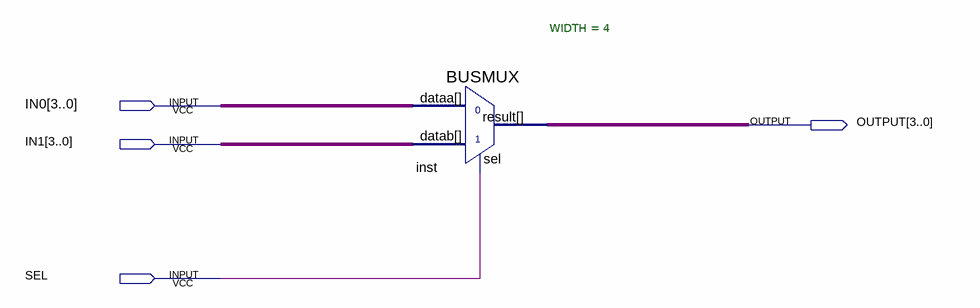
[diagram p0: schematic sheet]
// Quartus schematic BUXMUX1.bdf as structural Verilog: 1 symbols, 4 pins
module BUXMUX1 (
  input  [3:0] IN0,
  input  [3:0] IN1,
  input  SEL,
  output [3:0] OUTPUT
);

  BUSMUX #(.WIDTH(4)) inst (.datab(IN1), .sel(SEL), .dataa(IN0), .result(OUTPUT));
endmodule
